# EasyEDA Pro project ProDocument_大功率升压DCDC_2024-01-08.epro

# Schematic Schematic
Create Date: 2024-01-07; Page Name: P1; Project Name: TL494大功率升压电源; Schematic Name: Schematic; Update Date: 2024-01-07; Company: 嘉立创EDA; Page Size: A4; Version: V1.0
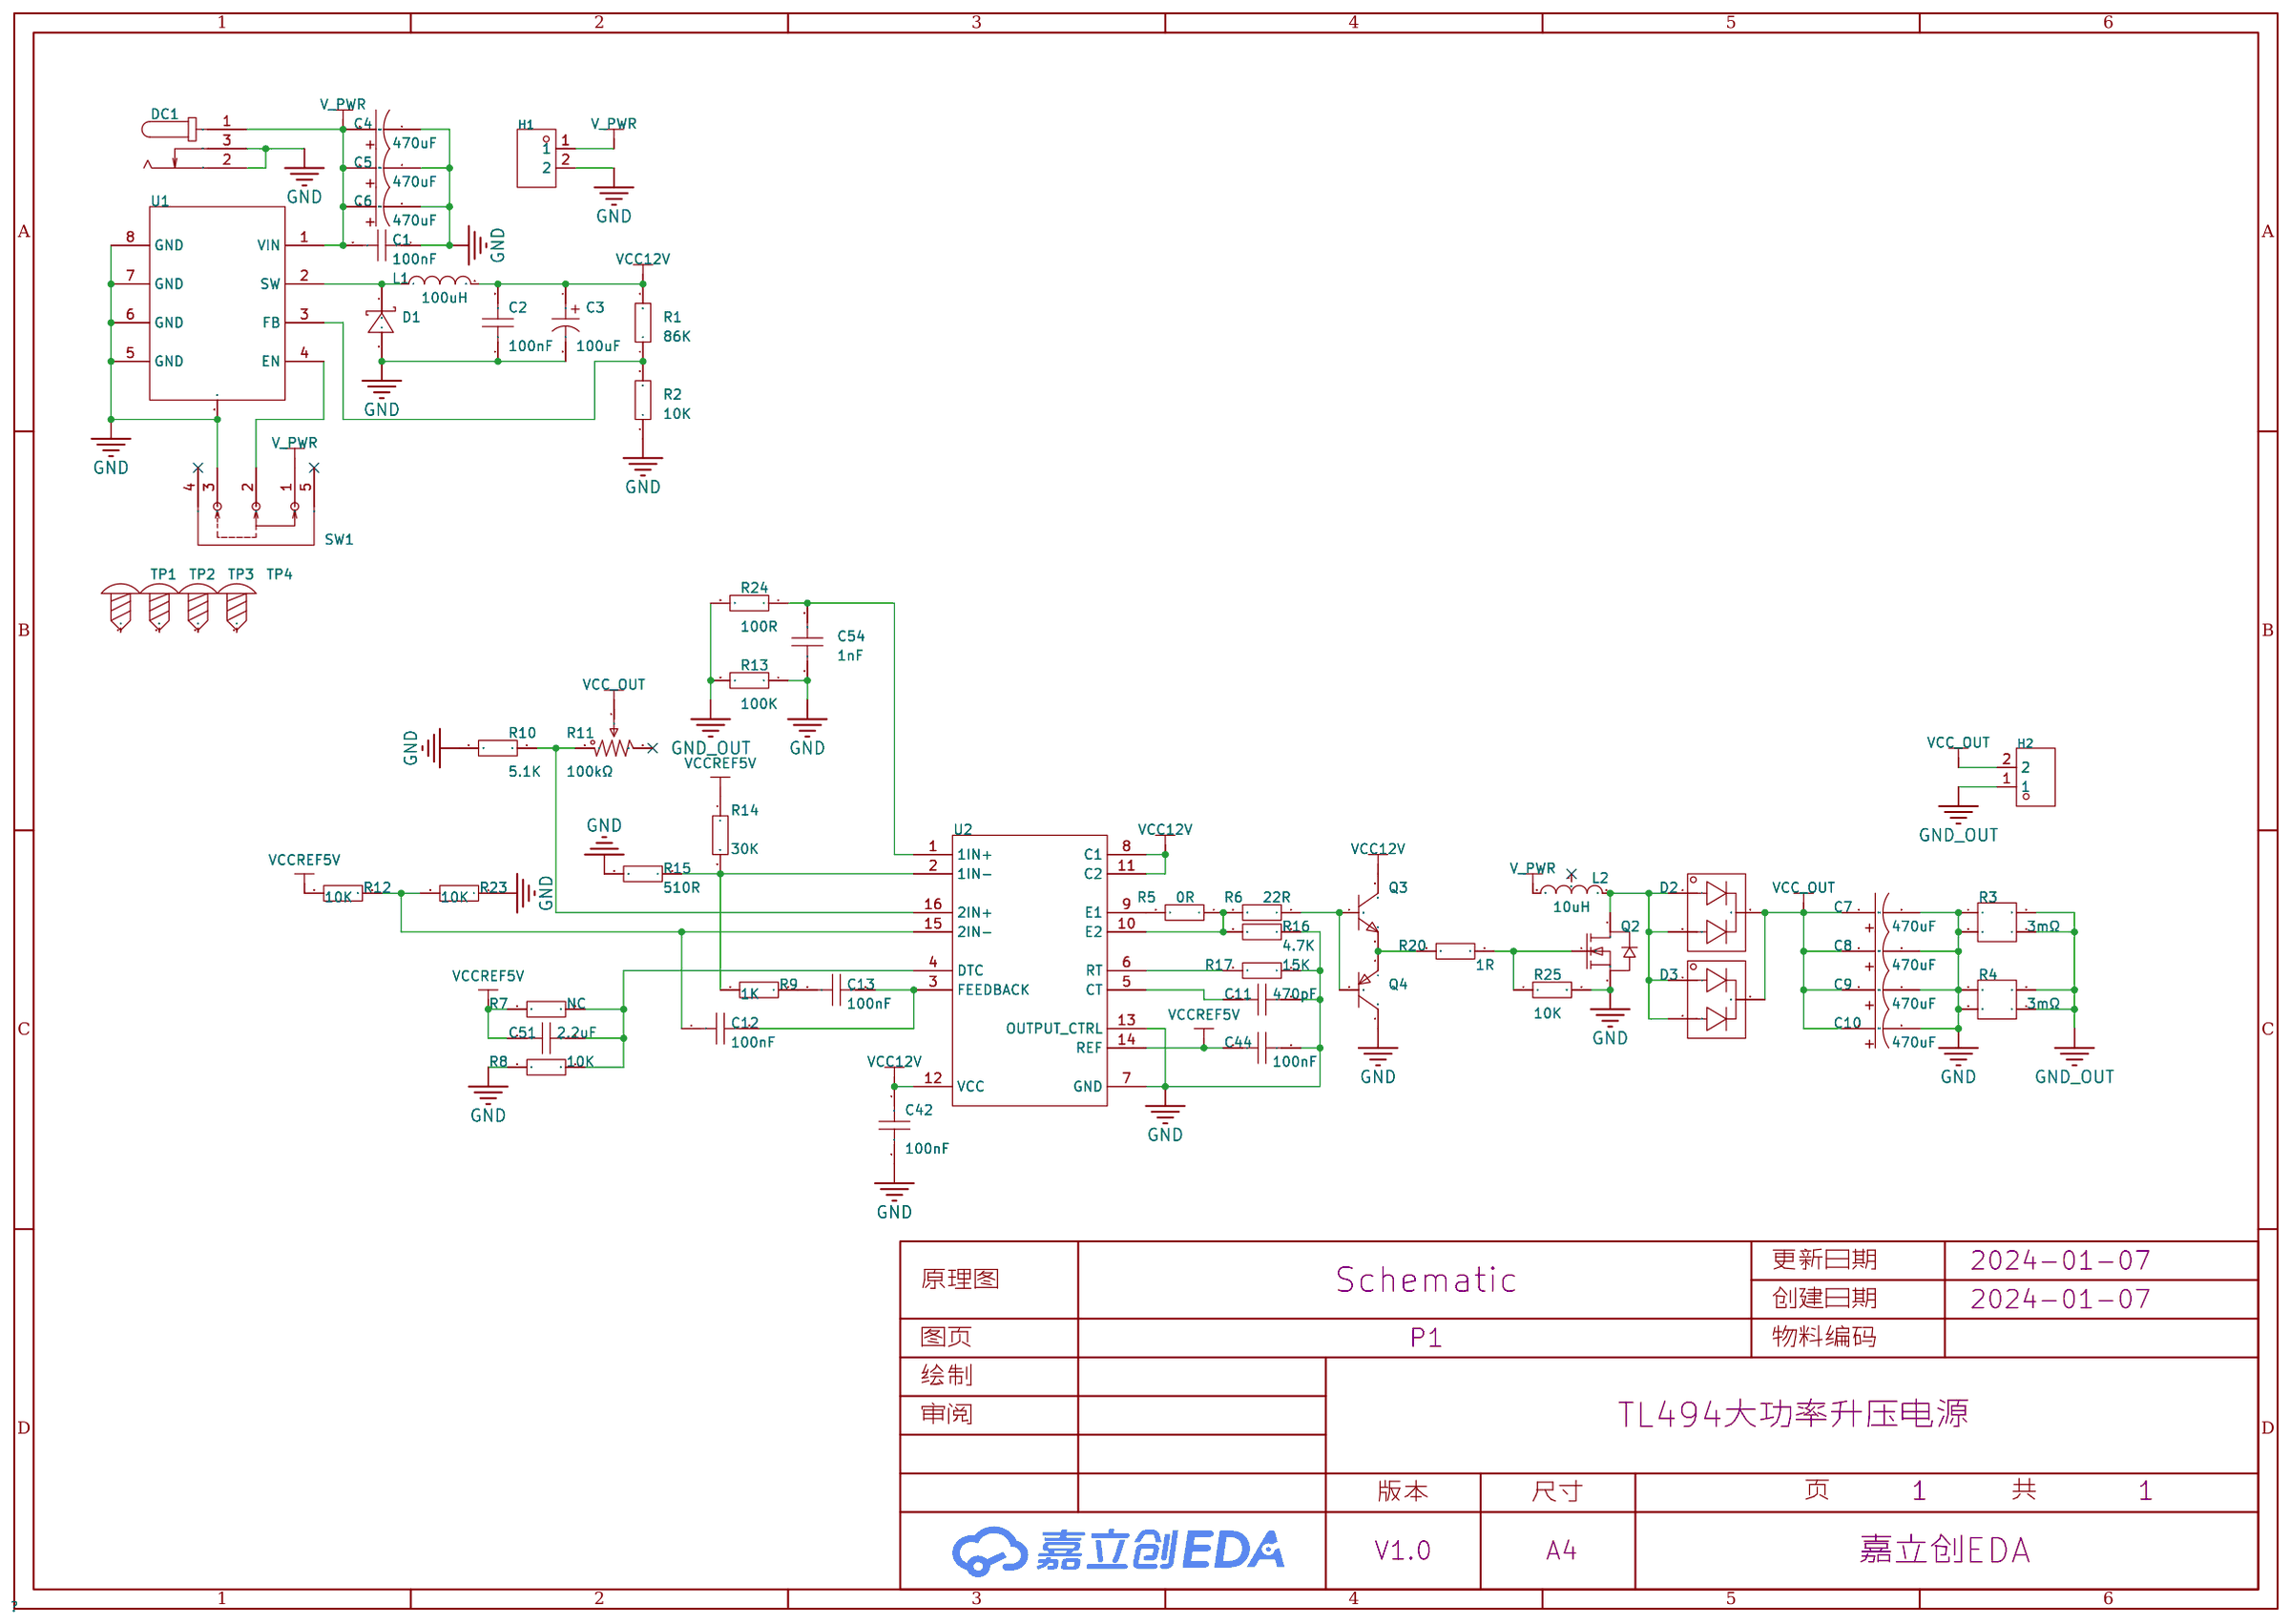
[diagram p0: schematic sheet]

## Parts
C1  100nF  [C0603]
C2  100nF  [C0603]
C3  100uF  [CAP-SMD_BD6.3-L6.6-W6.6-LS7.6-FD-1]
C4  470uF  [CAP-TH_BD16.0-P7.50-D1.2-FD]
C5  470uF  [CAP-TH_BD16.0-P7.50-D1.2-FD]
C6  470uF  [CAP-TH_BD16.0-P7.50-D1.2-FD]
C7  470uF  [CAP-TH_BD16.0-P7.50-D1.2-FD]
C8  470uF  [CAP-TH_BD16.0-P7.50-D1.2-FD]
C9  470uF  [CAP-TH_BD16.0-P7.50-D1.2-FD]
C10  470uF  [CAP-TH_BD16.0-P7.50-D1.2-FD]
C11  470pF  [C0603]
C12  100nF  [C0603]
C13  100nF  [C0603]
C42  100nF  [C0603]
C44  100nF  [C0603]
C51  2.2uF  [C0603]
C54  1nF  [C0603]
D1  SS210  [SMA_L4.3-W2.6-LS5.2-RD]
D2  MBRF20200CT  [ITO-220AB-3_L10.2-W4.5-P2.60-L]
D3  MBRF20200CT  [ITO-220AB-3_L10.2-W4.5-P2.60-L]
DC1  DC-005-20A  [DC-IN-TH_DC-005-20A]
H1  DBT50G-9.5-2P  [CONN-TH_2P-P9.50_DBT50G-9.5-2P]
H2  DBT50G-9.5-2P  [CONN-TH_2P-P9.50_DBT50G-9.5-2P]
L1  100uH  [IND-SMD_L7.1-W6.6]
L2  10uH  [IND-SMD_3P-L27.9-W19.7-P10.43-LS27.9-BL-A]
Q2  NCEP01T18T  [PG-TO247-3_L15.9-W5.2-P5.44-L]
Q3  D882 Y档160~320  [SOT-89-3_L4.5-W2.5-P1.50-LS4.2-BR]
Q4  B772  [SOT-89-3_L4.5-W2.5-P1.50-LS4.0-BR-1]
R1  86K  [R0603]
R2  10K  [R0603]
R3  3mΩ  [RES-TH_4P-L8.3-W5.3-P3.10-BL]
R4  3mΩ  [RES-TH_4P-L8.3-W5.3-P3.10-BL]
R5  0R  [R0603]
R6  22R  [R0603]
R7  NC  [R0603]
R8  10K  [R0603]
R9  1K  [R0603]
R10  5.1K  [R0603]
R11  100kΩ  [RES-ADJ-TH_3362P]
R12  10K  [R0603]
R13  100K  [R0603]
R14  30K  [R0603]
R15  510R  [R0603]
R16  4.7K  [R0603]
R17  15K  [R0603]
R20  1R  [R0603]
R23  10K  [R0603]
R24  100R  [R0603]
R25  10K  [R0603]
SW1  SK12D07VG4  [SW-TH_SK12D07VG4]
TP1  -  [M3螺丝]
TP2  -  [M3螺丝]
TP3  -  [M3螺丝]
TP4  -  [M3螺丝]
U1  XL7005A  [SOIC-8_L4.9-W3.9-P1.27-LS6.0-BL-EP3.1-1]
U2  TL494CDR  [SOIC-16_L9.9-W3.9-P1.27-LS6.0-BL]

## Library data of the parts
C1 C2 C11-C13 C42 C44 C51 C54 = CAP_0603: Supplier Footprint: 0603
C3 = RVE100UF35V67RV0072: 容值:100uF;精度:±20%;额定电压:35V;纹波电流:230mA@120Hz;等效串联电阻:600mΩ@100kHz;; LCSC Part Name: 100uF ±20% 35V; Supplier Part: C2836437; Manufacturer: KNSCHA(科尼盛); Supplier Footprint: SMD,D6.3xL7.7mm; JLCPCB Part Class: 扩展库; Datasheet: https://atta.szlcsc.com/upload/public/pdf/source/20220719/B52EB46F8A1558448ED03D8B4CB3C24F.pdf; Supplier: LCSC; Tolerance: ±20%; Rated Voltage: 35V; Ripple Current: 230mA@120Hz; Equivalent Series Resistance(ESR): 600mΩ@100kHz; φD: 6.3mm; L: 7.7mm; Lifetime @ Temp: 2000hrs@105℃; Operating Temperature: -55℃~+105℃
C4-C10 = ERE1KM471L25OT: 容值:470uF;精度:±20%;额定电压:100V;纹波电流:-;等效串联电阻:-;; LCSC Part Name: 470uF ±20% 100V; Supplier Part: C383056; Manufacturer: AISHI(艾华集团); Supplier Footprint: 插件,D16xL25mm; JLCPCB Part Class: 扩展库; Datasheet: https://atta.szlcsc.com/upload/public/pdf/source/20190327/C383056_BE3B42F0D1B85E811CB3E018D2C8340B.pdf; Supplier: LCSC; Tolerance: ±20%; Rated Voltage: 100V; φD: 16mm; L: 25mm; Lead Spacing: 7.5mm; Lifetime @ Temp: 4000hrs@105℃
D1 = SS210_C14996: 直流反向耐压(Vr):100V;平均整流电流(Io):2A;正向压降(Vf):850mV@2A;; LCSC Part Name: 100V 2A 850mV@2A; Supplier Part: C14996; Manufacturer: MDD; Supplier Footprint: SMA(DO-214AC); JLCPCB Part Class: Basic Part; Datasheet: https://atta.szlcsc.com/upload/public/pdf/source/20190304/C14996_C9642665EC53B919CC87DB9E28DB3D1C.pdf; Supplier: LCSC; Reverse Voltage (Vr): 100V; Average Rectified Current (Io): 2A; Forward Voltage (Vf@If): 850mV@2A
D2 D3 = MBRF20200CT_C173470: 正向压降(Vf):950mV@10A;直流反向耐压(Vr):200V;平均整流电流(Io):20A;; LCSC Part Name: 电压:200V 电流:20A; Supplier Part: C173470; Manufacturer: MDD; Supplier Footprint: ITO-220AB-3; JLCPCB Part Class: 扩展库; Datasheet: https://atta.szlcsc.com/upload/public/pdf/source/20230823/421A5F4987F420F8192EF3ADF2EEB7A4.pdf; Supplier: LCSC; Forward Voltage (Vf@If): 950mV@10A; Reverse Voltage (Vr): 200V; Average Rectified Current (Io): 20A
DC1 = DC-005-20A_C136744: 触点内径:2mm;触点外径:6.4mm;额定电流:500mA;额定电压:30V;; LCSC Part Name: DC-005-20A  内芯2.0mm 全铜; Supplier Part: C136744; Manufacturer: 韩国韩荣; Supplier Footprint: 插件; JLCPCB Part Class: 扩展库; Datasheet: https://atta.szlcsc.com/upload/public/pdf/source/20210810/D1FE451D887B1804F0660F580C4AD849.pdf; Supplier: LCSC; Inside Contact Diameter: 2mm; Outside Contact Diameter: 6.4mm; Current Rating (Max): 500mA; Voltage Rating (Max): 30V
H1 H2 = DBT50G-9.5-2P: 隔板类型:带盖板;间距:9.5mm;结构:1x2P;每排PIN数:2;排数:1;安装方式:直针;引脚位置:边脚;额定电流:32A;额定电压:750V;线规 - AWG:12~22;线规 - mm2:4;工作温度范围:-40℃~+105℃;颜色:黑色;; LCSC Part Name: 9.5mm 1x2P 每排P数:2 排数:1 直针 边脚; Supplier Part: C395958; Manufacturer: DIBO(地博电气); Supplier Footprint: 插件,P=9.5mm; JLCPCB Part Class: 扩展库; Datasheet: https://atta.szlcsc.com/upload/public/pdf/source/20230619/13ADDB604F78DE06B1EFD4F82CE20A46.pdf; Supplier: LCSC; Barrier Type: 带盖板; Pitch: 9.5mm; Structure: 1x2P; Number of PINs Per Row: 2; Number of Rows: 1; Mounting Style: 直针; Pin Location: 边脚; Current Rating (Max): 32A; Voltage Rating (Max): 750V; Wire Gauge - AWG: 12~22; Wire Gauge - mm2: 4; Operating Temperature Range: -40℃~+105℃; Color: 黑色
L1 = SMMS0650-101M: 电感值:100uH;精度:±20%;额定电流:1.5A;饱和电流(Isat):2A;; LCSC Part Name: 100uH ±20% 1.5A 595mΩ; Supplier Part: C2894722; Manufacturer: SXN(顺翔诺); Supplier Footprint: SMD,6.6x7.1mm; JLCPCB Part Class: 扩展库; Datasheet: https://atta.szlcsc.com/upload/public/pdf/source/20210910/523B6BB0C4A09F37806A127B1ABE761D.pdf; Supplier: LCSC; Tolerance: ±20%; Rated Current: 1.5A; Saturation Current (Isat): 2A; DC Resistance (DCR): 595mΩ
L2 = FC-SE2918-100M-28A: 电感值:10uH;精度:±20%;额定电流:30A;类型:-;饱和电流(Isat):32.1A;; LCSC Part Name: 10uH ±20% 32.1A; Supplier Part: C3037600; Manufacturer: FC(方成); Supplier Footprint: SMD; JLCPCB Part Class: 扩展库; Datasheet: https://atta.szlcsc.com/upload/public/pdf/source/20230712/96DF22DB850A53D8EF9E65329083AA7B.pdf; Supplier: LCSC; Tolerance: ±20%; Rated Current: 30A; DC Resistance (DCR): 2.6mΩ; Saturation Current (Isat): 32.1A
Q2 = NCEP01T18T: 类型:N沟道;漏源电压(Vdss):100V;连续漏极电流(Id):180A;功率(Pd):300W;导通电阻(RDS(on)@Vgs,Id):3mΩ@10V,100A;阈值电压(Vgs(th)@Id):4.5V@250uA;栅极电荷(Qg@Vgs):158nC@10V;输入电容(Ciss@Vds):11.5nF@50V;反向传输电容(Crss@Vds):75pF@50V;工作温度:-55℃~+175℃@(Tj);; LCSC Part Name: N沟道 100V 180A; Supplier Part: C503016; Manufacturer: NCE(无锡新洁能); Supplier Footprint: TO-247; JLCPCB Part Class: 扩展库; Datasheet: https://atta.szlcsc.com/upload/public/pdf/source/20200413/C503016_3DD20AD2994103B3C8639D8235341B8B.pdf; Supplier: LCSC; Type: N沟道; Drain Source Voltage (Vdss): 100V; Continuous Drain Current (Id): 180A; Power Dissipation (Pd): 300W; Drain Source On Resistance (RDS(on)@Vgs,Id): 3mΩ@10V,100A; Gate Threshold Voltage (Vgs(th)@Id): 4.5V@250uA; Total Gate Charge (Qg@Vgs): 158nC@10V; Input Capacitance (Ciss@Vds): 11.5nF@50V; Reverse Transfer Capacitance (Crss@Vds): 75pF@50V; Operating Temperature: -55℃~+175℃@(Tj)
Q3 = D882 Y档160~320: 晶体管类型:NPN;集射极击穿电压(Vceo):30V;集电极电流(Ic):3A;功率(Pd):500mW;; LCSC Part Name: NPN 30V 3A; Supplier Part: C9634; Manufacturer: CJ(江苏长电/长晶); Supplier Footprint: SOT-89-3; JLCPCB Part Class: 基础库; Datasheet: https://atta.szlcsc.com/upload/public/pdf/source/20121027/1457706543612.pdf; Supplier: LCSC; Transistor Type: NPN; Collector-Emitter Breakdown Voltage (Vceo): 30V; Collector Current (Ic): 3A; Power Dissipation (Pd): 500mW
Q4 = B772_C24278: 晶体管类型:PNP;集射极击穿电压(Vceo):30V;集电极电流(Ic):3A;功率(Pd):500mW;; LCSC Part Name: PNP 30V 3A; Supplier Part: C24278; Manufacturer: CJ(江苏长电/长晶); Supplier Footprint: SOT-89-3; JLCPCB Part Class: 扩展库; Datasheet: https://atta.szlcsc.com/upload/public/pdf/source/20140809/1457707213415.pdf; Supplier: LCSC; Transistor Type: PNP; Collector-Emitter Breakdown Voltage (Vceo): 30V; Collector Current (Ic): 3A; Power Dissipation (Pd): 500mW
R1 R2 R5-R10 R12-R17 R20 R23-R25 = Res_0603: Supplier Footprint: 0603
R3 R4 = HOBH3820-5W-3mR-1%: 阻值:3mΩ;精度:±1%;功率:5W;; LCSC Part Name: 3mΩ ±1% 5W; Supplier Part: C481549; Manufacturer: Milliohm(毫欧); Supplier Footprint: 插件; JLCPCB Part Class: 扩展库; Datasheet: https://atta.szlcsc.com/upload/public/pdf/source/20200508/C481544_9E1628625E50F6AD0BCA73B5002EA05D.pdf; Supplier: LCSC; Tolerance: ±1%; Power(Watts): 5W; Temperature Coefficient: ±50ppm/℃
R11 = 3362P-1-104: 阻值:100kΩ;精度:±10%;; LCSC Part Name: 100kΩ ±10%; Supplier Part: C118966; Manufacturer: BOCHEN(博晨); Supplier Footprint: 插件; JLCPCB Part Class: 扩展库; Datasheet: https://atta.szlcsc.com/upload/public/pdf/source/20171114/C118966_15106326666201117452.pdf; Supplier: LCSC; Tolerance: ±10%
SW1 = SK12D07VG4: 电路结构:单刀双掷;安装方式:卧插;额定电流(DC):500mA;额定电压(DC):50V;额定电流(AC):-;额定电压(AC):-;机械寿命:5千次;; LCSC Part Name: 3脚2档位 卧插 滑动开关; Supplier Part: C393937; Manufacturer: SHOU HAN(首韩); Supplier Footprint: 插件; JLCPCB Part Class: 扩展库; Datasheet: https://atta.szlcsc.com/upload/public/pdf/source/20190521/C393937_939FE26E571CC67D2D532E953108A1B0.pdf; Supplier: LCSC; Circuit: 单刀双掷; Actuator Style: 矩形柱状; Pin Style: PC引脚; Switch Height: 8.8mm; Mounting Style: 卧插; Current Rating (DC): 500mA; Voltage Rating (DC): 50V; Mechanical Life: 5千次
TP1-TP4 = M3螺丝: Supplier Footprint: 插件
U1 = XL7005A: 功能类型:降压型;同步整流:-;输出通道数:-;拓扑结构:-;输入电压:-;输出电流(最大值):-;开关频率:-;; LCSC Part Name: 降压型; Supplier Part: C50848; Manufacturer: XLSEMI(芯龙); Supplier Footprint: SOP-8-EP-150mil; JLCPCB Part Class: 扩展库; Datasheet: https://atta.szlcsc.com/upload/public/pdf/source/20150821/1457707346919.pdf; Supplier: LCSC; Function: 降压型
U2 = TL494CDR: TL494 脉冲宽度调制 (Pwm) 控制电路; Supplier Part: C19882; Manufacturer: TI(德州仪器); Supplier Footprint: SOIC-16-150mil; JLCPCB Part Class: Extended Part; Datasheet: https://atta.szlcsc.com/upload/public/pdf/source/20170919/C19882_1505799671377977592.pdf; Supplier: LCSC

## Nets
GND: C1.1 C2.1 C3.2 C4.2 C5.2 C6.2 C7.2 C8.2 C9.2 C10.2 C11.2 C42.2 C44.2 C54.1 D1.2(A) DC1.2 DC1.3 H1.2 Q2.3(S) Q4.2(C) R2.1 R3.1 R3.3 R4.1 R4.3 R8.2 R10.2 R13.1 R15.2 R16.1 R17.1 R23.1 R25.2 SW1.3 U1.5(GND) U1.6(GND) U1.7(GND) U1.8(GND) U1.9 U2.7(GND) U2.13(OUTPUT CTRL)
GND_OUT: H2.1 R3.2 R3.4 R4.2 R4.4 R13.2 R24.2
VCC12V: C2.2 C3.1 C42.1 L1.2 Q3.2(C) R1.2 U2.8(C1) U2.11(C2) U2.12(VCC)
VCC_OUT: C7.1 C8.1 C9.1 C10.1 D2.2 D3.2 H2.2 R11.2
VCCREF5V: C44.1 C51.1 R7.2 R12.2 R14.1 U2.14(REF)
V_PWR: C1.2 C4.1 C5.1 C6.1 DC1.1 H1.1 L2.2 SW1.1 U1.1(VIN)
$1N366: D1.1(K) L1.1 U1.2(SW)
$1N432: SW1.2 U1.4(EN)
$1N913: R1.1 R2.2 U1.3(FB)
$1N3166: R17.2 U2.6(RT)
$1N3167: C11.1 U2.5(CT)
$1N3287: R5.2 U2.9(E1)
$1N3291: R5.1 R6.2 R16.2 U2.10(E2)
$1N3419: C51.2 R7.1 R8.1 U2.4(DTC)
$1N3458: R10.1 R11.1 U2.16(2IN+)
$1N3799: C12.1 R12.1 R23.2 U2.15(2IN-)
$1N3920: C54.2 R24.1 U2.1(1IN+)
$1N4058: C12.2 C13.2 U2.3(FEEDBACK)
$1N4096: R9.2 R14.2 R15.1 U2.2(1IN-)
$1N4130: C13.1 R9.1
$1N9204: D2.1 D2.3 D3.1 D3.3 L2.1 Q2.2(D)
$1N9281: Q2.1(G) R20.1 R25.1
$1N9403: Q3.3(E) Q4.3(E) R20.2
$1N9456: Q3.1(B) Q4.1(B) R6.1

Not connected (* = marked no-connect by the designer): L2 3*; R11 3*; SW1 4* 5*; TP1 1; TP2 1; TP3 1; TP4 1

# Board PCB
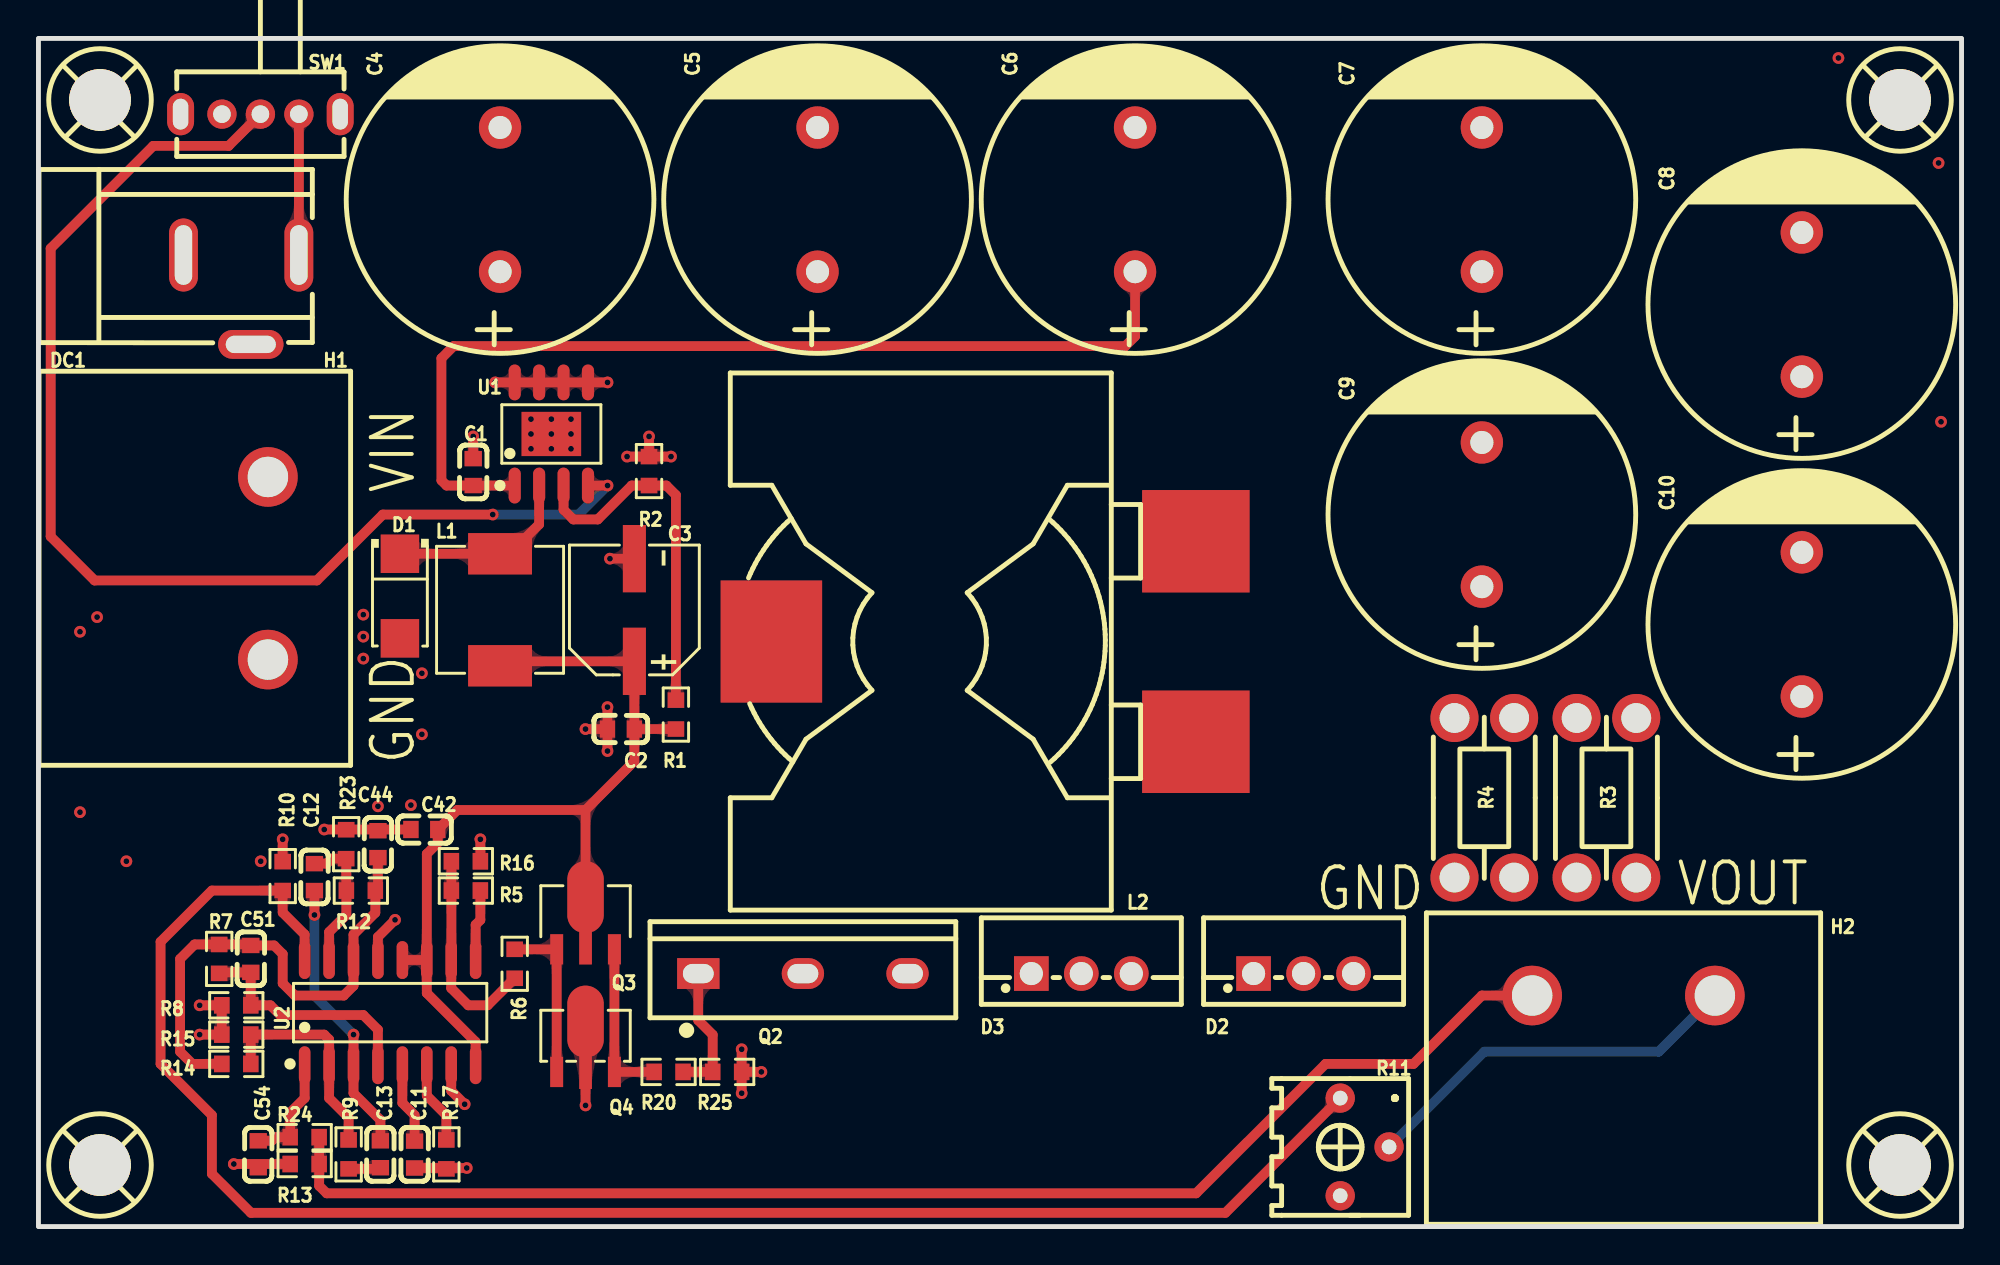
[diagram p1: board, top side]
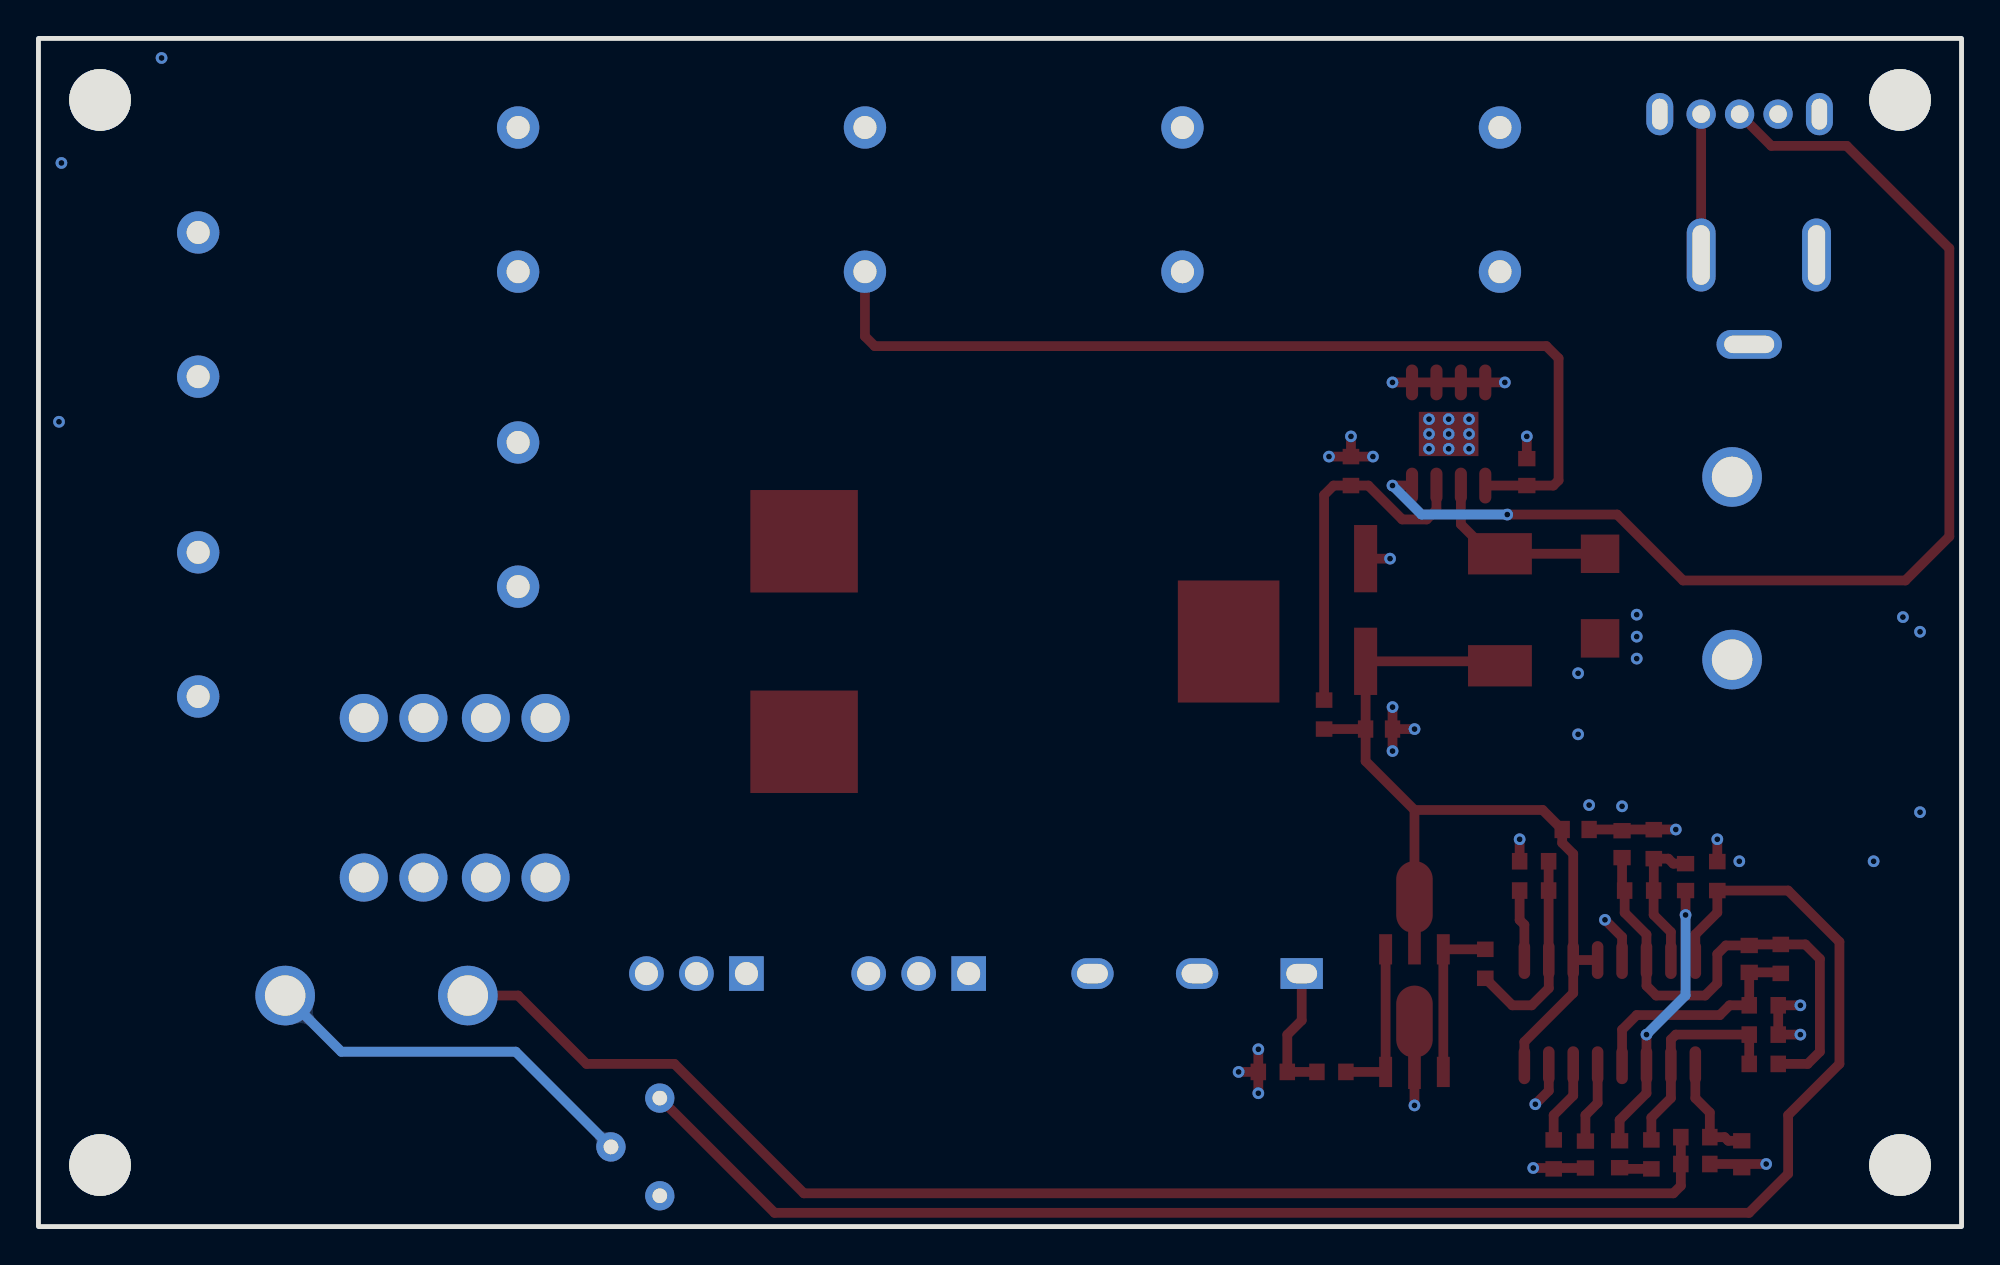
[diagram p2: board, bottom side, seen from below]

Outline 100 x 61.8 mm; copper layers: Top Layer, Bottom Layer. Coordinates in mm from the lower left corner of the outline.
Outline path: rectangle 0,61.8 100,0
Stack: Top Layer 0.035mm / Dielectric1 1.51mm FR4 er 4.5 / Bottom Layer 0.035mm

## Design rules (mm)
template: 自定义配置
spacing copperThickness1oz (default): track to track 0.102, other pairs 0.152 to 0.3
spacing copperThickness2oz: track to track 0.203, other pairs 0.152 to 0.3
track width copperThickness1oz (default): min 0.127, default 0.254, max 5.08
track width copperThickness2oz: min 0.203, default 0.254, max 2.54
differential pair differentialPair (default): width min 0.127, default 0.254, max 2.54; gap min 0.152, default 0.152
via viaSize (default): diameter min 0.5, default 0.61, max 10; hole min 0.3, default 0.305, max 6.299

## Placement (name value [footprint] x y rotation side)
C1  100nF  [C0603]  22.61 39.24 270 top
C2  100nF  [C0603]  30.29 25.88 0 top
C3  100uF  [CAP-SMD_BD6.3-L6.6-W6.6-LS7.6-FD-1]  30.99 32.07 90 top
C4  470uF  [CAP-TH_BD16.0-P7.50-D1.2-FD]  24 53.42 90 top
C5  470uF  [CAP-TH_BD16.0-P7.50-D1.2-FD]  40.51 53.42 90 top
C6  470uF  [CAP-TH_BD16.0-P7.50-D1.2-FD]  57.02 53.42 90 top
C7  470uF  [CAP-TH_BD16.0-P7.50-D1.2-FD]  75.06 53.42 90 top
C8  470uF  [CAP-TH_BD16.0-P7.50-D1.2-FD]  91.69 47.96 90 top
C9  470uF  [CAP-TH_BD16.0-P7.50-D1.2-FD]  75.06 37.04 90 top
C10  470uF  [CAP-TH_BD16.0-P7.50-D1.2-FD]  91.69 31.32 90 top
C11  470pF  [C0603]  19.56 3.75 270 top
C12  100nF  [C0603]  14.35 18.18 270 top
C13  100nF  [C0603]  17.78 3.76 90 top
C42  100nF  [C0603]  20.07 20.65 180 top
C44  100nF  [C0603]  17.65 19.89 90 top
C51  2.2uF  [C0603]  11.04 13.92 270 top
C54  1nF  [C0603]  11.43 3.76 90 top
D1  SS210  [SMA_L4.3-W2.6-LS5.2-RD]  18.8 32.8 270 top
D2  MBRF20200CT  [ITO-220AB-3_L10.2-W4.5-P2.60-L]  65.79 13.16 0 top
D3  MBRF20200CT  [ITO-220AB-3_L10.2-W4.5-P2.60-L]  54.23 13.16 0 top
DC1  DC-005-20A  [DC-IN-TH_DC-005-20A]  10.54 48.21 0 top
H1  DBT50G-9.5-2P  [CONN-TH_2P-P9.50_DBT50G-9.5-2P]  11.93 34.24 270 top
H2  DBT50G-9.5-2P  [CONN-TH_2P-P9.50_DBT50G-9.5-2P]  82.42 12.02 0 top
L1  100uH  [IND-SMD_L7.1-W6.6]  24 32.08 270 top
L2  10uH  [IND-SMD_3P-L27.9-W19.7-P10.43-LS27.9-BL-A]  49.15 30.43 90 top
Q2  NCEP01T18T  [PG-TO247-3_L15.9-W5.2-P5.44-L]  39.75 13.16 0 top
Q3  D882 Y档160~320  [SOT-89-3_L4.5-W2.5-P1.50-LS4.2-BR]  28.45 15.78 270 top
Q4  B772  [SOT-89-3_L4.5-W2.5-P1.50-LS4.0-BR-1]  28.45 9.35 270 top
R1  86K  [R0603]  33.15 26.63 270 top
R2  10K  [R0603]  31.75 39.3 270 top
R3  3mΩ  [RES-TH_4P-L8.3-W5.3-P3.10-BL]  81.53 22.3 270 top
R4  3mΩ  [RES-TH_4P-L8.3-W5.3-P3.10-BL]  75.18 22.3 270 top
R5  0R  [R0603]  22.22 17.48 0 top
R6  22R  [R0603]  24.77 13.67 270 top
R7  NC  [R0603]  9.4 13.92 90 top
R8  10K  [R0603]  10.29 11.51 180 top
R9  1K  [R0603]  16.13 3.75 90 top
R10  5.1K  [R0603]  12.7 18.23 90 top
R11  100kΩ  [RES-ADJ-TH_3362P]  68.96 4.14 270 top
R12  10K  [R0603]  16.76 17.48 0 top
R13  100K  [R0603]  13.84 3.25 0 top
R14  30K  [R0603]  10.29 8.46 0 top
R15  510R  [R0603]  10.29 9.98 180 top
R16  4.7K  [R0603]  22.22 19 180 top
R17  15K  [R0603]  21.21 3.75 90 top
R20  1R  [R0603]  32.77 8.04 180 top
R23  10K  [R0603]  16 19.89 270 top
R24  100R  [R0603]  13.84 4.65 0 top
R25  10K  [R0603]  35.81 8.04 0 top
SW1  SK12D07VG4  [SW-TH_SK12D07VG4]  11.54 57.86 180 top
TP1  -  [M3螺丝]  3.26 58.54 0 top
TP2  -  [M3螺丝]  3.26 3.14 0 top
TP3  -  [M3螺丝]  96.86 58.54 0 top
TP4  -  [M3螺丝]  96.86 3.14 0 top
U1  XL7005A  [SOIC-8_L4.9-W3.9-P1.27-LS6.0-BL-EP3.1-1]  26.67 41.23 0 top
U2  TL494CDR  [SOIC-16_L9.9-W3.9-P1.27-LS6.0-BL]  18.29 11.13 0 top

## Footprints (pads in the part's own frame, mm; a bottom-side part is the same pattern mirrored in y, then rotated)
C0603
  rect 0.8x0.9 smd: 1(-0.7,0) 2(0.7,0)
CAP-SMD_BD6.3-L6.6-W6.6-LS7.6-FD-1
  rect 3.5x1.2 smd: 1(-2.67,0) 2(2.67,0)
CAP-TH_BD16.0-P7.50-D1.2-FD
  round 2.2 hole 1.2: 1(-3.75,0) 2(3.75,0)
CONN-TH_2P-P9.50_DBT50G-9.5-2P
  round 3.1 hole 2.1: 1(-4.75,0) 2(4.75,0)
DC-IN-TH_DC-005-20A
  oval 1.5x3.8 hole 0.9x3.1: 1(3,2.325) 2(-3,2.325)
  oval 3.4x1.5 hole 2.6x0.9: 3(0.5,-2.325)
IND-SMD_3P-L27.9-W19.7-P10.43-LS27.9-BL-A
  rect 5.33x5.59 smd: 1(-5.215,-11.037) 2(5.215,-11.037)
  rect 6.35x5.28 smd: 3(0,11.037)
IND-SMD_L7.1-W6.6
  rect 2.15x3.32 smd: 1(-2.913,0) 2(2.913,0)
ITO-220AB-3_L10.2-W4.5-P2.60-L
  rect 1.8x1.8 hole 1.2: 1(-2.6,0)
  round 1.8 hole 1.2: 2(0,0) 3(2.6,0)
M3螺丝
  round 3.2 hole 3.2: 1(-0.064,0.064)
PG-TO247-3_L15.9-W5.2-P5.44-L
  rect 2.2x1.6 hole 1.6x1: 1(-5.44,0)
  oval 2.2x1.6 hole 1.6x1: 2(0,0) 3(5.44,0)
R0603
  rect 0.806x0.864 smd: 1(-0.753,0) 2(0.753,0)
RES-ADJ-TH_3362P
  round 1.524 hole 0.762: 1(-2.54,-1.27) 2(0,1.27) 3(2.54,-1.27)
RES-TH_4P-L8.3-W5.3-P3.10-BL
  round 2.5 hole 1.55: 1(-4.15,-1.55) 2(4.15,-1.55) 3(-4.15,1.55) 4(4.15,1.55)
SMA_L4.3-W2.6-LS5.2-RD
  rect 2x2 smd: 1(-2.2,0) 2(2.2,0)
SOIC-8_L4.9-W3.9-P1.27-LS6.0-BL-EP3.1-1
  oval 0.63x1.865 smd: 1(-1.905,-2.683) 2(-0.635,-2.683) 3(0.635,-2.683) 4(1.905,-2.683) 5(1.905,2.683) 6(0.635,2.683) 7(-0.635,2.683) 8(-1.905,2.683)
  rect 3.1x2.3 smd: 9(0,0)
SOIC-16_L9.9-W3.9-P1.27-LS6.0-BL
  oval 0.602x1.971 smd: 1(-4.445,-2.736) 2(-3.175,-2.736) 3(-1.905,-2.736) 4(-0.635,-2.736) 5(0.635,-2.736) 6(1.905,-2.736) 7(3.175,-2.736) 8(4.445,-2.736) 9(4.445,2.736) 10(3.175,2.736) 11(1.905,2.736) 12(0.635,2.736) 13(-0.635,2.736) 14(-1.905,2.736) 15(-3.175,2.736) 16(-4.445,2.736)
SOT-89-3_L4.5-W2.5-P1.50-LS4.0-BR-1
  rect 1.575x0.672 smd: 1(1.306,-1.5) 3(1.306,1.5)
  custom 5.377x1.9 smd: 2(-1.306,0)
SOT-89-3_L4.5-W2.5-P1.50-LS4.2-BR
  rect 1.575x0.672 smd: 1(1.356,-1.5) 3(1.356,1.5)
  custom 5.377x1.9 smd: 2(-1.356,0)
SW-TH_SK12D07VG4
  round 1.524 hole 0.914: 1(-2,0) 2(0,0) 3(2,0)
  oval 1.4x2.2 hole 0.8x1.6: 4(4.15,0) 5(-4.15,0)

## Nets
As in the schematic.

Pads without a net: L2 3; R11 3; SW1 4 5; TP1 1; TP2 1; TP3 1; TP4 1

## Via types
v1: diameter 0.61, hole 0.305, Top Layer to Bottom Layer, 51 vias

## Routing (per net, layer and track width the routed paths; a pad name or vN(x,y) marks a point on that pad's centre or on a via; arc(x,y) is an arc through that point)
GND: length 43.8
  Top Layer w0.508: v1(8.38,9.98) R15.2 R8.2 v1(8.38,11.51) ; U2.7 21.46,7.06 v1(22.16,6.36) ; C3.2 v1(29.72,34.74) ; v1(23.75,43.91) U1.8 U1.7 U1.6 U1.5 v1(29.59,43.91) ; v1(14.86,20.65) C42.2 ; C1.1 v1(22.61,41.1) ; C11.2 v1(22.27,3.05) ; R16.1 v1(22.98,20.14) ; U2.13 17.65,15.06 v1(18.54,15.95) ; R2.1 v1(30.61,40.05) ; R2.1 v1(32.89,40.05) ; R2.1 v1(31.75,41.1) ; Q4.2 v1(28.45,6.3) ; R10.2 v1(12.7,20.14) ; R25.2 v1(36.57,6.94) ; R25.2 v1(37.59,8.04) ; R25.2 v1(36.57,9.22) ; R13.1 v1(10.16,3.25) ; v1(29.59,27.02) C2.1 ; C2.1 v1(29.59,24.73) ; C2.1 v1(28.44,25.88)
  Bottom Layer w0.508: v1(36.57,6.94) 36.58,6.94
  vias: v1(2.16,30.94) v1(2.16,21.55) v1(3.05,31.7) v1(4.57,19) v1(11.56,19) v1(16.89,31.83) v1(16.89,30.69) v1(16.89,29.54) v1(17.65,21.86) v1(19.37,21.92) v1(19.94,28.78) v1(19.94,25.61) v1(25.61,42) v1(25.61,41.23) v1(25.61,40.45) v1(26.67,42) v1(26.67,41.23) v1(26.67,40.45) v1(27.69,42) v1(27.69,41.23) v1(27.69,40.45) v1(93.6,60.78) v1(98.81,55.32) v1(98.93,41.86)
GND_OUT: length 70
  Top Layer w0.508: H2.1 75.06,12.02 71.5,8.46 66.93,8.46 60.2,1.73 14.99,1.73 14.6,2.12 R13.2 R24.2
VCC12V: length 45.5
  Top Layer w0.508: C2.2 R1.2 ; C2.2 C3.1 24.23,29.4 L1.2 ; C2.2 30.99,24.21 28.45,21.67 ; 28.45,21.67 21.78,21.67 C42.1 20.77,19.96 20.19,19.38 U2.11 ; 28.45,21.67 Q3.2 ; U2.11 U2.12 ; U2.11 20.19,12.14 22.73,9.6 U2.8
VCC_OUT: length 20.2
  Bottom Layer w0.508: H2.2 84.25,9.1 75.18,9.1 R11.2
VCCREF5V: length 26
  Top Layer w0.508: R14.1 8,8.46 7.37,9.1 7.37,13.92 8.12,14.67 R7.2 10.99,14.67 C51.1 12.25,14.62 12.7,14.18 12.7,12.65 13.33,12.02 15.88,12.02 16.38,12.52 U2.14 16.38,15.19 17.52,16.33 R12.2 17.65,17.61 C44.1
V_PWR: length 57.5
  Top Layer w0.508: SW1.1 DC1.1 ; U1.1 C1.2 21.22,38.54 20.95,38.81 20.95,45.16 21.59,45.8 56.51,45.8 57.02,46.31 C6.1
$1N366: length 9.9
  Top Layer w0.508: U1.2 26.03,36.53 24.5,35 L1.1 D1.1
$1N432: length 61.7
  Top Layer w0.508: U1.4 v1(29.59,38.54) ; SW1.2 9.89,56.21 5.97,56.21 0.64,50.88 0.64,35.89 2.92,33.61 14.48,33.61 17.91,37.04 v1(23.62,37.04)
  Bottom Layer w0.508: v1(29.59,38.54) 28.08,37.04 v1(23.62,37.04)
$1N913: length 18.9
  Top Layer w0.508: R1.1 33.15,38.05 32.65,38.54 R2.2 30.85,38.54 29.08,36.78 27.81,36.78 27.31,37.29 U1.3
$1N3166: length 4.3
  Top Layer w0.508: U2.6 20.19,6.81 21.21,5.79 21.21,4.51
$1N3167: length 4.2
  Top Layer w0.508: C11.1 19.56,5.79 18.92,6.43 U2.5
$1N3287: length 3.7
  Top Layer w0.508: U2.9 22.73,15.7 22.98,15.94 R5.2
$1N3291: length 10.9
  Top Layer w0.508: R6.2 23.36,11.51 22.35,11.51 21.46,12.4 U2.10 21.47,13.87 R5.1 R16.2
$1N3419: length 12.4
  Top Layer w0.508: R7.1 9.45,13.22 C51.2 R8.1 12.06,11.51 12.57,11 16.89,11 17.65,10.24 U2.4
$1N3458: length 86.7
  Top Layer w0.508: R11.1 61.72,0.71 11.05,0.71 9.02,2.75 9.02,5.79 6.35,8.46 6.35,14.81 9.02,17.48 R10.1 12.7,16.33 13.84,15.19 13.84,13.86
$1N3799: length 7.4
  Top Layer w0.508: U2.15 15.11,15.32 16.01,16.22 R12.1 16,17.49 R23.2 15.25,19.14 14.99,18.88 C12.1
$1N3920: length 5.8
  Top Layer w0.508: 11.43,4.46 12.13,4.46 12.32,4.65 R24.1 13.09,5.93 13.84,6.68 13.84,8.39
$1N4058: length 14.4
  Top Layer w0.508: v1(14.35,16.21) C12.2 ; v1(16.38,9.98) U2.3 16.38,6.94 17.78,5.54 17.78,4.46
  Bottom Layer w0.508: v1(16.38,9.98) 14.35,12.02 v1(14.35,16.21)
$1N4096: length 11.3
  Top Layer w0.508: R14.2 R15.1 14.86,9.98 15.11,9.73 U2.2 15.11,6.68 16.13,5.67 16.13,4.51
$1N4130: length 1.7
  Top Layer w0.508: 17.78,3.06 17.72,3 R9.1
$1N9281: length 7
  Top Layer w0.508: R20.1 R25.1 35.06,9.98 34.31,10.73 Q2.1
$1N9403: length 8.4
  Top Layer w0.508: R20.2 Q4.3 Q3.3
$1N9456: length 8.6
  Top Layer w0.508: Q4.1 Q3.1 R6.1

## Copper pours and planes (outline as drawn; the poured copper is in the pictures)
GND on Top Layer: 19.94,32.46 20.57,31.83 20.57,25.22 19.94,24.59 19.94,20.27 19.69,20.02 13.72,20.02 13.46,19.76 13.46,18.75 13.21,18.49 4.19,18.49 1.4,21.29 1.4,31.19 2.67,32.46
GND on Top Layer: 64.26,55.83 68.71,51.39 68.71,27.26 74.29,21.67 96.14,21.67 99.44,24.97 99.44,58.5 96.39,61.55 21.46,61.55 20.45,60.53 20.45,56.85 21.46,55.83
GND on Bottom Layer: 101.22,64.21 103.89,61.55 103.89,0.97 100.97,-1.95 0.38,-1.95 -1.65,0.08 -1.65,61.42 1.14,64.21
GND_OUT on Top Layer: 73.66,20.65 83.31,20.65 84.71,19.26 84.71,15.83 82.93,14.05 82.93,10.62 81.03,8.71 74.55,8.71 72.14,11.13 72.14,19.13
GND_OUT on Bottom Layer: 72.52,20.27 84.07,20.27 84.84,19.51 84.84,15.57 79.25,9.98 75.56,9.98 71.75,13.79 71.75,19.51
VCC12V on Top Layer: 31.75,31.32 32,31.07 32,28.02 31.75,27.76 22.35,27.76 21.97,28.15 21.97,30.94 22.35,31.32
VCC_OUT on Bottom Layer: 65.79,11.25 71.25,16.72 71.25,29.42 72.26,30.43 86.11,30.43 87.88,28.65 87.88,18.24 83.31,13.67 83.31,11.13 86.36,8.08 94.36,8.08 99.44,13.16 99.44,40.21 88.01,51.64 71.75,51.64 50.93,30.81 50.93,14.56 54.23,11.25
V_PWR on Top Layer: 14.1,34.37 20.19,40.46 20.19,45.54 21.34,46.69 55.88,46.69 56.26,46.31 56.26,32.97 57.28,31.96 65.91,31.96 68.2,34.24 68.2,51.28 63.9,55.58 6.48,55.58 1.4,50.5 1.4,36.61 3.64,34.37
V_PWR on Bottom Layer: 14.61,52.78 15.75,51.64 41.02,51.64 42.54,50.12 42.54,48.34 40.89,46.69 21.34,46.69 16.13,41.48 16.13,39.19 13.84,36.91 10.41,36.91 9.65,37.67 9.65,41.48 13.33,45.16 13.33,48.08 12.45,48.97 12.45,52.15 13.08,52.78
$1N9204 on Top Layer: 65.79,28.91 71.37,23.32 71.37,10.75 70.36,9.73 39.5,9.73 37.59,11.64 37.59,22.18 44.32,28.91

Small or netless copper shapes (teardrops, artwork), in the pictures only: 136 on Top Layer, 2 on Bottom Layer

## Text on the board
Top Silkscreen Layer: VIN | GND | VOUT
